# EAGLE board Vocodec_rev2_2 (EAGLE 6.5.0), part 1 of 2
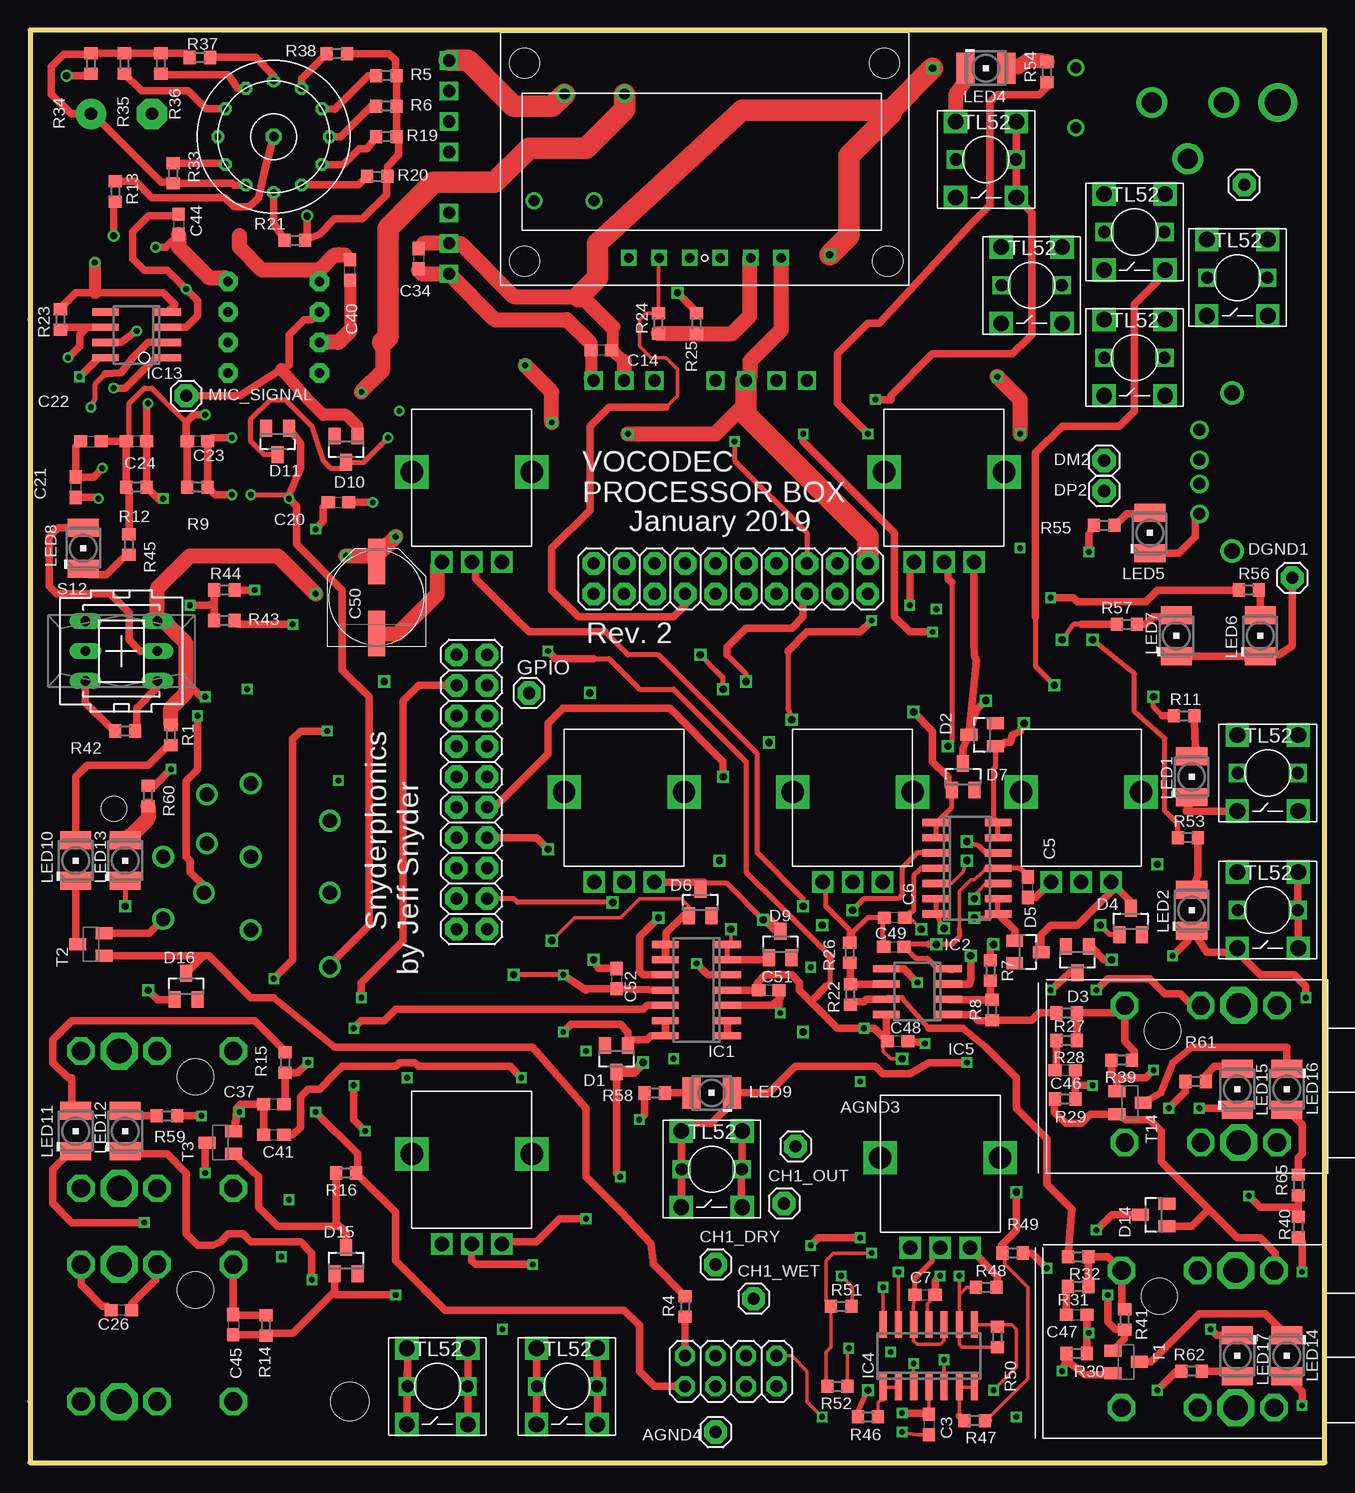
[diagram p3: board, top side]
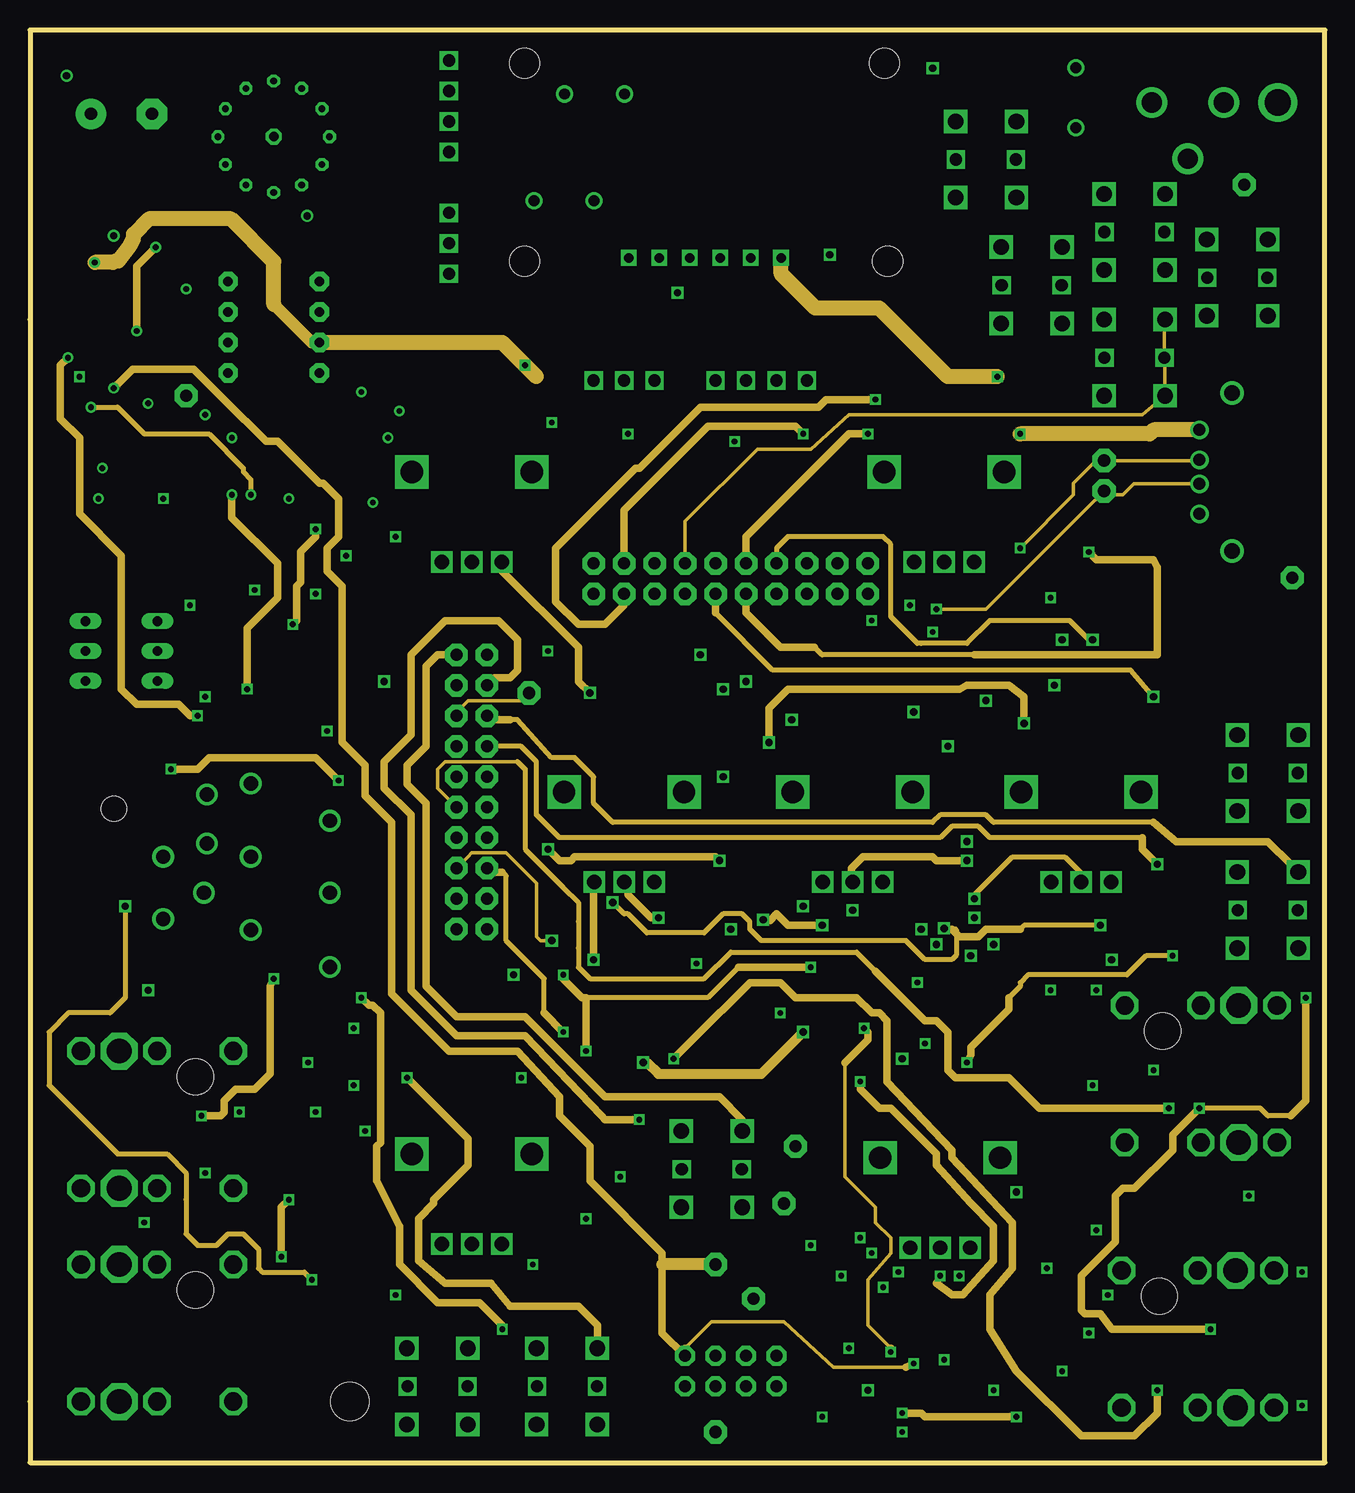
[diagram p4: board, inner layer Route2]
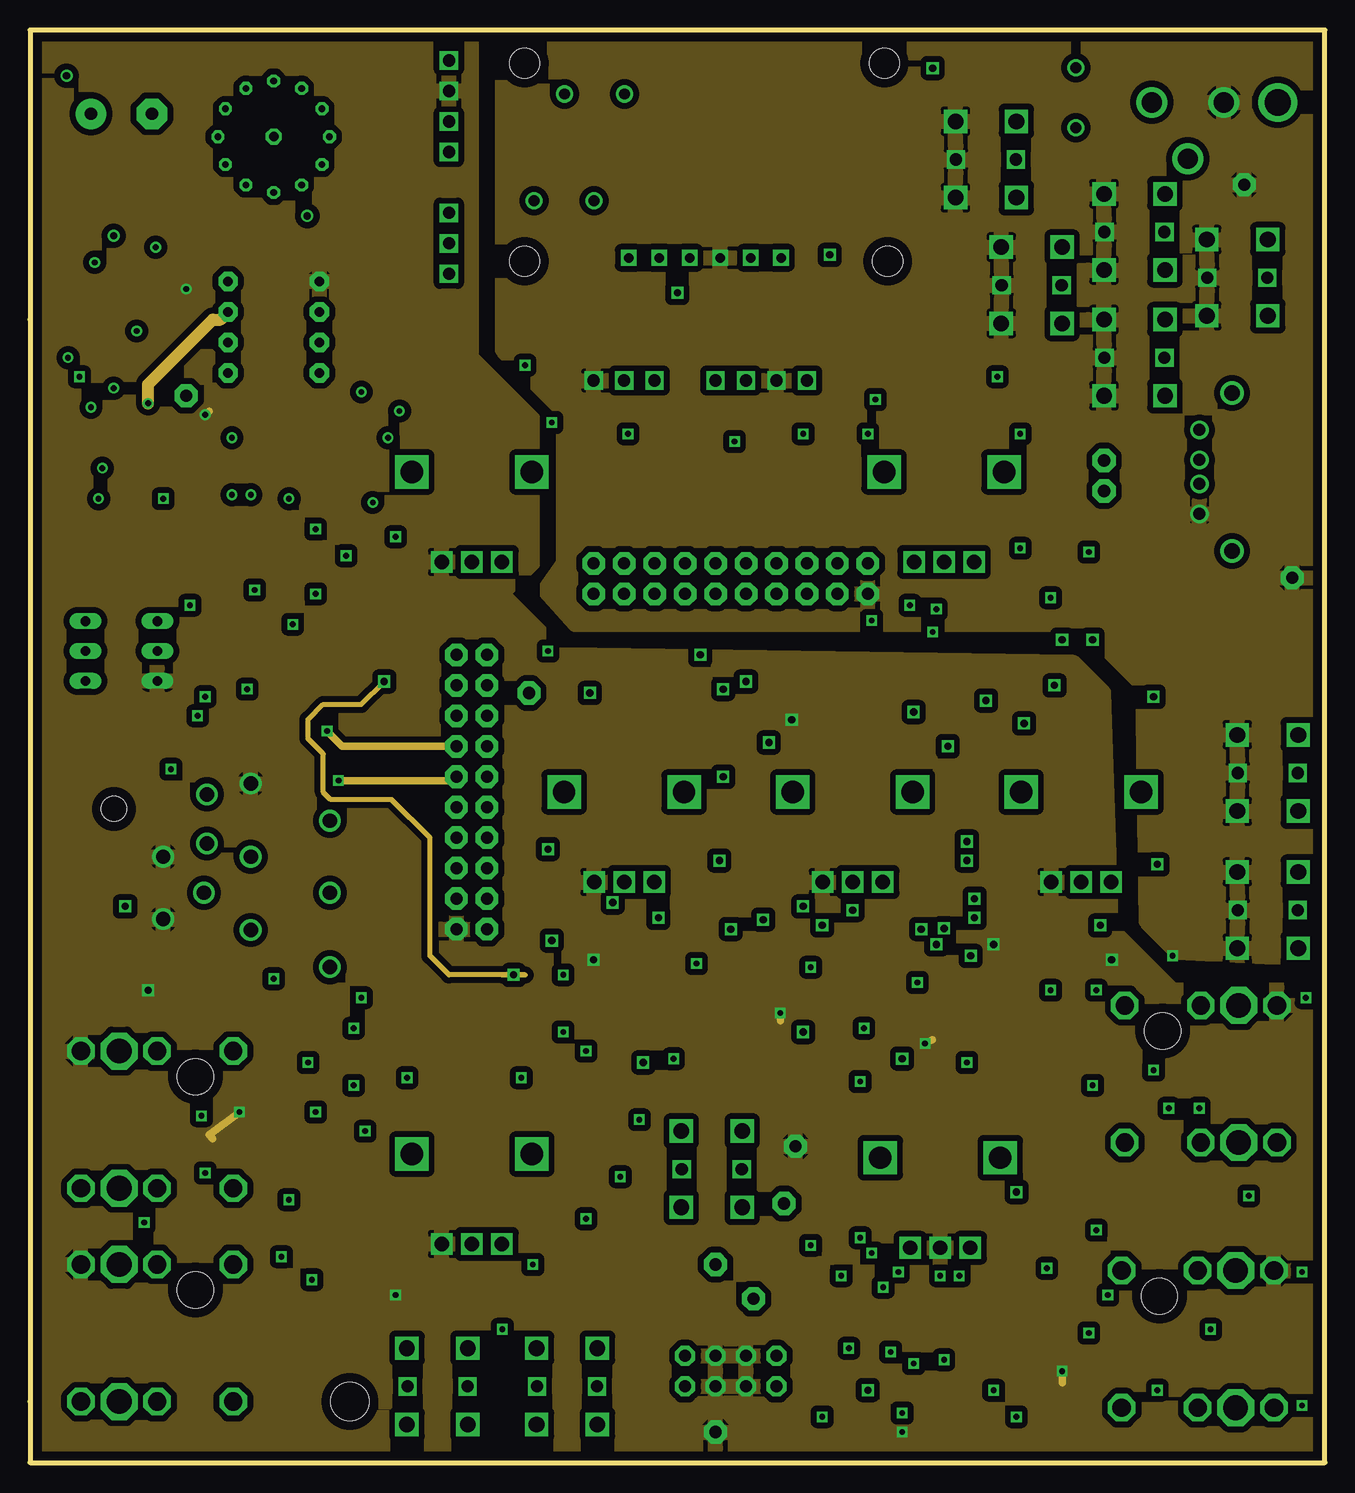
[diagram p5: board, inner layer Route15]
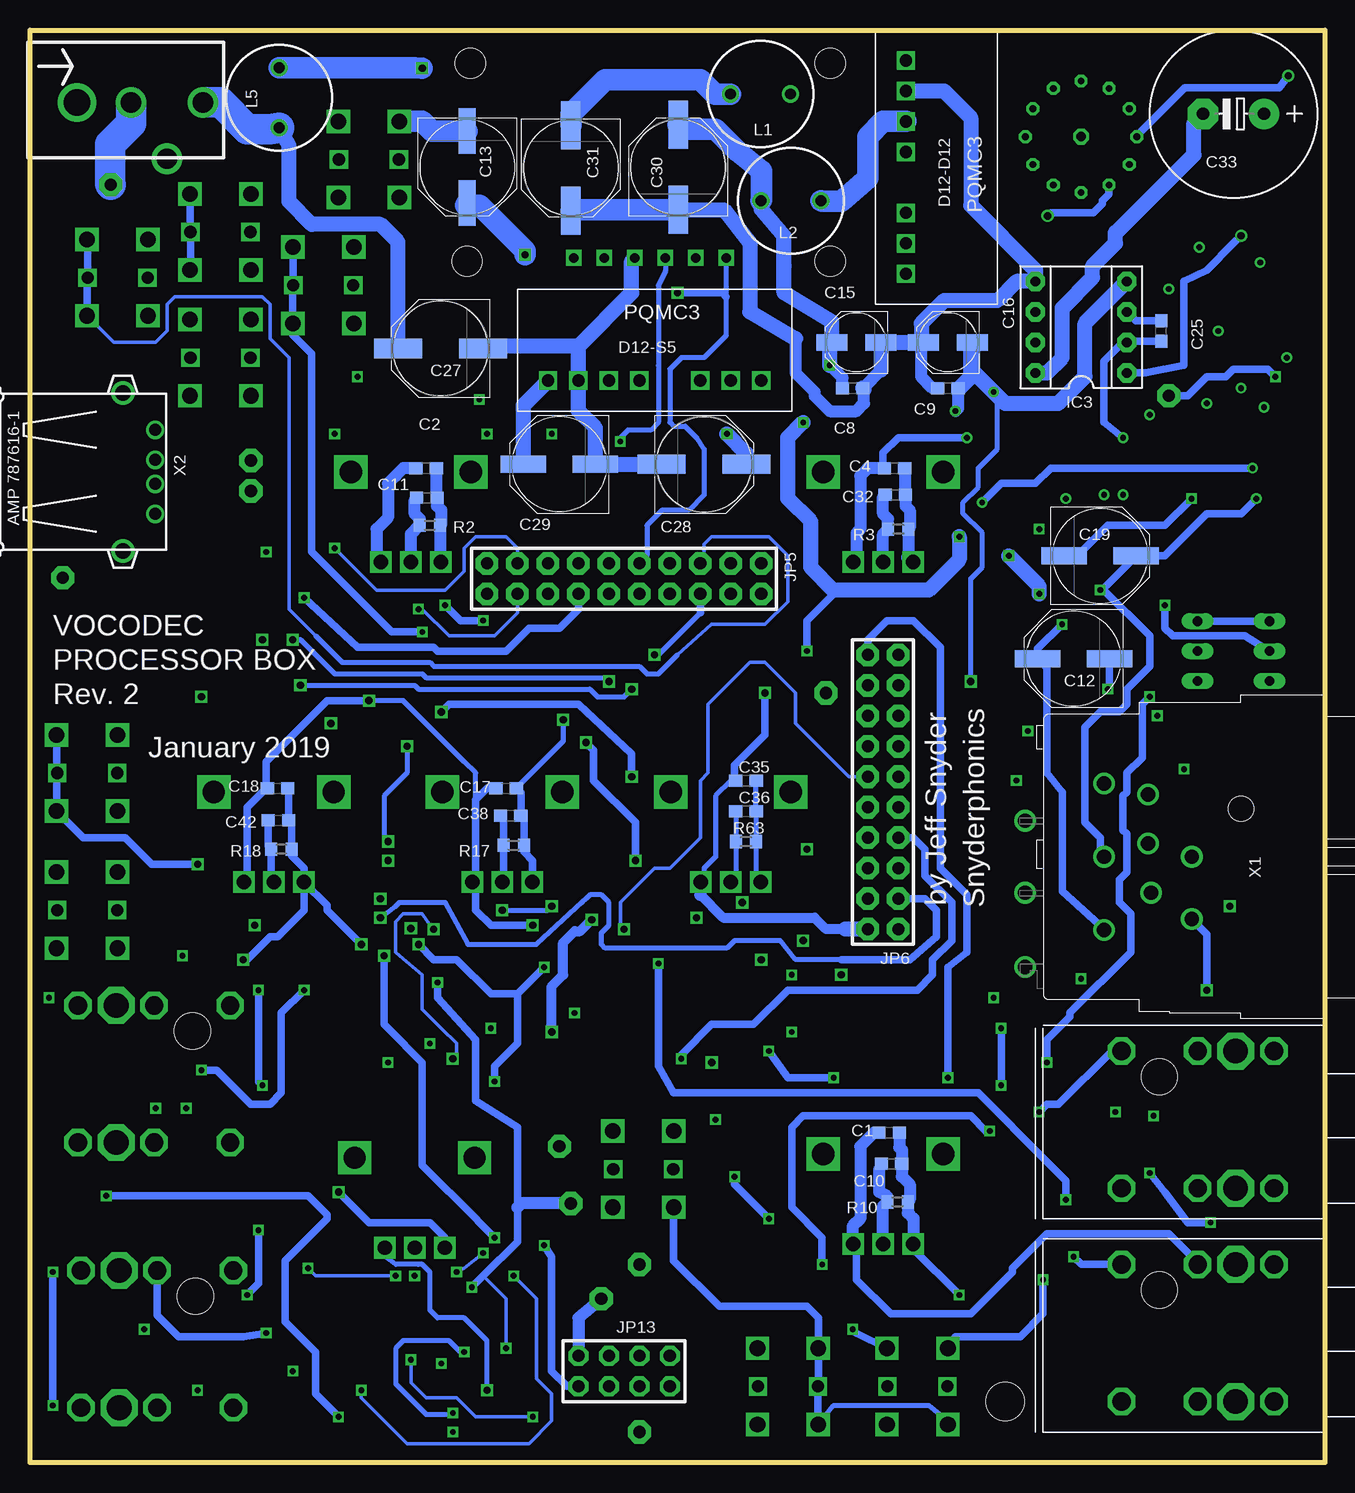
[diagram p6: board, bottom side, seen from below]

Size 107.95 x 119.38 mm. Coordinates in mm from the lower left corner, seen from the top.
Outline: 0,95.25 0,5.08 0,0 107.95,0 107.95,119.38 0,119.38 0,95.25
Copper layers (1+2*15+16): Top 0.035mm / dielectric 1mm / Route2 0.035mm / dielectric 1mm / Route15 0.035mm / dielectric 1mm / Bottom 0.035mm
Design rules "default *": minimum track width 12mil, minimum drill 19mil, track to track 20mil, track to pad 10mil, pad to pad 10mil, via to via 10mil, smd to smd 10mil, copper to edge 30mil, drill to drill 10mil, minimum pad ring 10mil, minimum via ring 8mil, stop-mask expansion 3mil, vias tented up to drill 0mil, thermal gap 10mil
Net classes: 1 POWER: width 0.813 mm, drill 0.559 mm, clearance 0.254 mm; 3 +12V: width 0.61 mm, drill 0.483 mm, clearance 0.254 mm
Holes 3.17 mm at 26.67,5.08 0,124.46 107.95,124.46 107.95,-5.08 0,-5.08
Milling: 4 lines

## Footprints (pad centres in the part's own frame; a part is rotated, then mirrored left to right if it is on the bottom)
1X01 = drill 1.016 pad 1.93 octagon: 1 0,0
C0603 = smd 1.1 x 1: 1 -0.85,0; 2 0.85,0
PANASONIC_E = smd 3.8 x 1.4: + 3,0; - -3,0
PANASONIC_C = smd 2.6 x 1.4: + 2.05,0; - -2.05,0
PANASONIC_F = smd 4 x 1.6: + 3.55,0; - -3.55,0
E5-13 = drill 1.016 pad 2.54: + -2.54,0 | drill 1.016 pad 2.54 octagon: - 2.54,0
SOT23 = smd 1 x 1.4: 1 -0.95,-1.1; 2 0.95,-1.1; 3 0,1.1
SO14 = smd 0.6 x 2.2: 1 -3.81,-2.6; 2 -2.54,-2.6; 3 -1.27,-2.6; 4 0,-2.6; 5 1.27,-2.6; 6 2.54,-2.6; 7 3.81,-2.6; 8 3.81,2.6; 9 2.54,2.6; 10 1.27,2.6; 11 0,2.6; 12 -1.27,2.6; 13 -2.54,2.6; 14 -3.81,2.6
DIL08 = drill 0.813 pad 1.6 octagon: 1 -3.81,-3.81; 2 -1.27,-3.81; 3 1.27,-3.81; 4 3.81,-3.81; 5 3.81,3.81; 6 1.27,3.81; 7 -1.27,3.81; 8 -3.81,3.81
SO08 = smd 0.6 x 2.2: 1 -1.905,-2.6; 2 -0.635,-2.6; 3 0.635,-2.6; 4 1.905,-2.6; 5 1.905,2.6; 6 0.635,2.6; 7 -0.635,2.6; 8 -1.905,2.6
PQMC3-D12-D12-S = drill 1.016 square: P$1 -7.62,0; P$2 -5.08,0; P$3 -2.54,0; P$4 2.54,0; P$5 5.08,0; P$6 7.62,0; P$7 10.16,0
SO8 = smd 0.6 x 2.2: 1 -1.905,-2.6; 2 -0.635,-2.6; 3 0.635,-2.6; 4 1.905,-2.6; 5 1.905,2.6; 6 0.635,2.6; 7 -0.635,2.6; 8 -1.905,2.6
NRJ6HF2 = drill 2.057 octagon: POST1 -7.442,0; POST2 -7.442,-11.43 | drill 1.524 octagon: R -10.6,0; RN -10.6,-11.43; S -4.25,0; SN -4.25,-11.43; T -16.942,0; TN -16.942,-11.43 | hole 2.997: -13.792,-2.134
PJ-059B = drill 1.7: 1 3,0; 2 -3,0; 3 0,-4.7 | drill 2.2: P$1 -7.5,0
2X10 = drill 1.016 pad 1.88 octagon: 1 -11.43,-1.27; 2 -11.43,1.27; 3 -8.89,-1.27; 4 -8.89,1.27; 5 -6.35,-1.27; 6 -6.35,1.27; 7 -3.81,-1.27; 8 -3.81,1.27; 9 -1.27,-1.27; 10 -1.27,1.27; 11 1.27,-1.27; 12 1.27,1.27; 13 3.81,-1.27; 14 3.81,1.27; 15 6.35,-1.27; 16 6.35,1.27; 17 8.89,-1.27; 18 8.89,1.27; 19 11.43,-1.27; 20 11.43,1.27
2X04 = drill 1.016 pad 1.676 octagon: 1 -3.81,-1.27; 2 -3.81,1.27; 3 -1.27,-1.27; 4 -1.27,1.27; 5 1.27,-1.27; 6 1.27,1.27; 7 3.81,-1.27; 8 3.81,1.27
6000-XXXX-RC = drill 0.9 pad 1.422: 1 -2.5,0; 2 2.5,0
PLCC2 = smd 2.6 x 1.5: A 0,1.7; C 0,-1.7
ADAFRUIT_128X32_OLED = drill 0.8 square: P$1 10.668,2.286; P$2 13.208,2.286; P$3 15.748,2.286; P$4 18.288,2.286; P$5 20.828,2.286; P$6 23.368,2.286 | hole 2.489: 2,2; 2,18.5; 32,18.5; 32.258,2
R0603 = smd 1 x 1.1: 1 -0.85,0; 2 0.85,0
PVA2F = drill 0.813 long: 1 -2.997,2.489; 2 -2.997,0; 3 -2.997,-2.489; 4 2.997,2.489; 5 2.997,0; 6 2.997,-2.489
SOT23-BEC = smd 1 x 1.4: B -0.95,-1.1; C 0,1.1; E 0.95,-1.1
56DP30 = drill 0.559 octagon: 1 4.023,-2.324; 2 2.324,-4.023; 3 0,-4.648; 4 -2.324,-4.023; 5 -4.023,-2.324; 6 -4.648,0; 7 -4.023,2.324; 8 -2.324,4.023; 9 0,4.648; 10 2.324,4.023; 11 4.025,2.324; 12 4.648,0 | drill 0.8 octagon: C 0,0
TL52_PLUS = drill 1.016 square: P1_1 -2.5,0; P2_1 2.5,0 | drill 1.3 square: P1_2 -2.54,3.175; P1_3 -2.54,-3.175; P2_2 2.54,3.175; P2_3 2.54,-3.175
RK09 = drill 1.2 square: 1-09 -2.5,-7.5; 2-09 0,-7.5; 3-09 2.5,-7.5 | drill 1.854 square: MOUNT1 -5,0; MOUNT2 5,0
NCJ10FI-H-0 = drill 1.2: 1 -6.1,-18.4; 2 6.1,-18.4; 3 0,-18.4; G 0,-11.1; GN -1.1,-14.75; R -5.2,-14.75; RS -3,-25; S 5.2,-11.1; SS 3,-14.5; T 9.2,-25; TS 3,-25 | hole 2.1: -4,-7
USB = drill 1: 1 -3.5,12.99; 2 -1,12.99; 3 1,12.99; 4 3.5,12.99 | drill 1.3: P$1 -6.57,10.28; P$2 6.57,10.28

## Placement (x,y rotation side)
AGND3  [1X01]  63.82,26.35 0 top
AGND4  [1X01]  57.15,2.54 0 top
C1  .1uf  [C0603]  36.32,27.5 0 bottom
C2  .1uf  [C0603]  74.93,82.87 0 bottom
C3  .1uf  [C0603]  74.93,3.17 270 top
C4  .1uf  [C0603]  35.88,82.87 0 bottom
C5  .1uf  [C0603]  83.19,47.94 90 top
C6  .1uf  [C0603]  72.07,45.4 180 top
C7  .1uf  [C0603]  74.61,13.97 0 top
C8  .33uf  [C0603]  39.37,89.53 0 bottom
C9  .33uf  [C0603]  31.43,89.53 0 bottom
C10  .01uf  [C0603]  36.13,24.89 0 bottom
C11  .01uf  [C0603]  74.87,80.39 0 bottom
C12  47uf  [PANASONIC_E]  20.96,66.99 180 bottom
C13  47uf  [PANASONIC_E]  71.5,107.95 270 bottom
C14  .1uf  [C0603]  47.62,92.71 180 top
C15  10uf  [PANASONIC_C]  39.05,93.34 180 bottom
C16  10uf  [PANASONIC_C]  31.43,93.34 180 bottom
C17  .1uf  [C0603]  68.26,56.2 0 bottom
C18  .1uf  [C0603]  87.31,56.2 0 bottom
C19  47uf  [PANASONIC_E]  18.73,75.56 0 bottom
C20  470pf  [C0603]  25.72,80.01 0 top
C21  470pf  [C0603]  3.81,81.28 270 top
C22  47pf  [C0603]  5.08,85.09 0 top
C23  100pf  [C0603]  13.97,85.09 180 top
C24  100pf  [C0603]  8.89,85.09 180 top
C25  220pf  [C0603]  13.65,94.3 90 bottom
C26  .1uf  [C0603]  7.62,12.7 180 top
C27  100uf  [PANASONIC_F]  73.72,92.84 180 bottom
C28  100uf  [PANASONIC_F]  51.75,83.19 0 bottom
C29  47uf  [PANASONIC_E]  63.82,83.19 180 bottom
C30  100uf  [PANASONIC_F]  53.91,107.95 90 bottom
C31  100uf  [PANASONIC_F]  62.86,107.89 270 bottom
C32  .01uf  [C0603]  35.81,80.64 0 bottom
C33  3300uf  [E5-13]  7.62,112.39 180 bottom
C34  .1uf  [C0603]  32.38,100.33 270 top
C35  .1uf  [C0603]  48.26,56.83 0 bottom
C36  .01uf  [C0603]  48.26,54.29 0 bottom
C37  .1uf  [C0603]  20.32,29.84 180 top
C38  .01uf  [C0603]  67.88,53.91 0 bottom
C40  .1uf  [C0603]  26.67,99.38 90 top
C41  .1uf  [C0603]  20.32,27.3 0 top
C42  .01uf  [C0603]  87.25,53.53 0 bottom
C44  .1uf  [C0603]  12.38,103.19 270 top
C45  .01uf  [C0603]  16.95,11.49 270 top
C46  220pf  [C0603]  86.3,32.7 0 top
C47  220pf  [C0603]  87.25,12.32 0 top
C48  .1uf  [C0603]  72.33,35.12 0 top
C49  .1uf  [C0603]  72.01,42.99 0 top
C50  47uf  [PANASONIC_E]  28.89,72.07 90 top
C51  .1uf  [C0603]  61.59,39.37 0 top
C52  .1uf  [C0603]  48.89,40.32 270 top
CH1_DRY  [1X01]  57.15,16.51 0 top
CH1_OUT  [1X01]  62.86,21.59 0 top
CH1_WET  [1X01]  60.33,13.65 0 top
D1  BAT54  [SOT23]  48.89,33.66 180 top
D2  BAT54  [SOT23]  79.38,60.64 90 top
D3  BAT54  [SOT23]  87.31,41.91 180 top
D4  BAT54  [SOT23]  91.76,45.09 0 top
D5  BAT54  [SOT23]  83.19,42.55 270 top
D6  BAT54  [SOT23]  55.88,46.67 0 top
D7  BAT54  [SOT23]  77.79,57.15 0 top
D9  BAT54  [SOT23]  62.55,43.18 0 top
D10  BAT54  [SOT23]  26.35,84.45 180 top
D11  BAT54  [SOT23]  20.64,85.09 180 top
D14  BAT54  [SOT23]  93.66,20.64 90 top
D15  BAT54  [SOT23]  26.35,16.83 0 top
D16  BAT54  [SOT23]  13.02,39.69 0 top
DGND1  [1X01]  105.22,73.72 0 top
DM2  [1X01]  89.53,83.5 0 top
DP2  [1X01]  89.53,80.96 0 top
GPIO  [1X01]  41.59,64.14 0 top
IC1  TL074D  [SO14]  55.56,39.37 90 top
IC2  TL074D  [SO14]  78.11,49.53 270 top
IC3  INA217P  [DIL08]  20.32,94.61 90 bottom
IC4  TL074D  [SO14]  74.93,8.89 0 top
IC5  NE5532D  [SO08]  73.98,39.24 90 top
IC11  PQMC3-D12-D12-S  [PQMC3-D12-D12-S]  34.92,106.68 90 bottom
IC12  PQMC3-D12-S5-S  [PQMC3-D12-D12-S]  54.61,90.17 180 bottom
IC13  DG469  [SO8]  8.89,93.98 90 top
J1  NRJ6HF2  [NRJ6HF2]  0,34.29 0 bottom
J3  NRJ6HF2  [NRJ6HF2]  108.2,38.1 0 top
J4  NRJ6HF2  [NRJ6HF2]  107.95,16 0 top
J9  NRJ6HF2  [NRJ6HF2]  0,16.51 0 bottom
J10  PJ-059B  [PJ-059B]  96.52,113.35 0 bottom
JP5  [2X10]  58.42,73.66 0 top
JP6  [2X10]  36.83,55.88 90 top
JP13  [2X04]  58.42,7.62 0 top
JP20  [1X01]  101.22,106.49 90 top
L1  [6000-XXXX-RC]  47.05,114.05 180 bottom
L2  [6000-XXXX-RC]  44.51,105.16 180 bottom
L5  [6000-XXXX-RC]  87.19,113.73 90 bottom
LED1  AMBER  [PLCC2]  96.84,57.15 0 top
LED2  GREEN  [PLCC2]  96.84,46.04 0 top
LED4  RED  [PLCC2]  79.69,116.2 270 top
LED5  GREEN  [PLCC2]  93.34,77.47 0 top
LED6  AMBER  [PLCC2]  102.55,68.9 0 top
LED7  RED  [PLCC2]  95.57,68.9 0 top
LED8  GREEN  [PLCC2]  4.45,76.2 0 top
LED9  GREEN  [PLCC2]  56.83,30.8 90 top
LED10  AMBER  [PLCC2]  3.81,50.16 0 top
LED11  AMBER  [PLCC2]  3.81,27.62 0 top
LED12  RED  [PLCC2]  7.94,27.62 0 top
LED13  RED  [PLCC2]  7.94,50.16 0 top
LED14  AMBER  [PLCC2]  104.77,8.89 180 top
LED15  RED  [PLCC2]  100.65,31.12 0 top
LED16  AMBER  [PLCC2]  104.77,31.12 180 top
LED17  RED  [PLCC2]  100.65,8.89 180 top
MIC_SIGNAL  [1X01]  13.02,88.9 0 top
OLED1  ADAFRUIT_931_OLED_128X32  [ADAFRUIT_128X32_OLED]  39.24,98.11 0 top
R1  1k  [R0603]  11.75,60.64 270 top
R2  1M  [R0603]  74.61,78.11 180 bottom
R3  1M  [R0603]  35.56,77.79 180 bottom
R4  200k  [R0603]  54.61,13.02 90 top
R5  1k  [R0603]  29.72,115.57 0 top
R6  2k  [R0603]  29.72,113.03 0 top
R7  10k  [R0603]  80.07,41.02 270 top
R8  10k  [R0603]  80.2,37.72 90 top
R9  1k15  [R0603]  13.97,81.28 0 top
R10  1M  [R0603]  35.62,21.72 180 bottom
R11  560R  [R0603]  96.2,62.23 0 top
R12  1k15  [R0603]  8.89,81.28 0 top
R13  5.1R  [R0603]  7.11,105.92 270 top
R14  1M  [R0603]  19.69,11.43 90 top
R15  1k  [R0603]  21.27,33.34 90 top
R16  200k  [R0603]  26.35,24.13 180 top
R17  1M  [R0603]  67.63,51.44 180 bottom
R18  1M  [R0603]  87,51.12 180 bottom
R19  4.7k  [R0603]  29.72,110.49 0 top
R20  10k  [R0603]  28.96,107.19 0 top
R21  20k  [R0603]  22.1,101.85 0 top
R22  10k  [R0603]  68.39,38.99 90 top
R23  10k  [R0603]  2.54,95.25 90 top
R24  1k  [R0603]  52.39,94.93 90 top
R25  1k  [R0603]  55.56,94.93 90 top
R26  10k  [R0603]  68.33,42.48 90 top
R27  220R  [R0603]  86.42,37.46 180 top
R28  220R  [R0603]  86.42,35.18 180 top
R29  220R  [R0603]  86.3,30.29 0 top
R30  220R  [R0603]  87.25,9.08 0 top
R31  220R  [R0603]  87.38,14.67 180 top
R32  220R  [R0603]  87.38,17.14 180 top
R33  5.1R  [R0603]  11.94,107.44 270 top
R34  15R  [R0603]  5.08,116.59 90 top
R35  47R  [R0603]  7.87,116.59 90 top
R36  91R  [R0603]  10.92,116.59 90 top
R37  200R  [R0603]  14.16,117.09 180 top
R38  510R  [R0603]  25.59,117.41 0 top
R39  200k  [R0603]  91,33.53 180 top
R40  1k  [R0603]  105.73,19.62 270 top
R41  200k  [R0603]  91.25,11.94 270 top
R42  47k  [R0603]  7.94,60.96 180 top
R43  680R  [R0603]  16.19,70.17 0 top
R44  680R  [R0603]  16.19,72.71 0 top
R45  680R  [R0603]  8.25,76.52 270 top
R46  15k  [R0603]  69.85,3.81 0 top
R47  15k  [R0603]  78.74,3.49 180 top
R48  15k  [R0603]  79.69,14.61 0 top
R49  15k  [R0603]  81.91,17.46 180 top
R50  51k  [R0603]  80.64,10.48 270 top
R51  15k  [R0603]  67.63,13.02 0 top
R52  15k  [R0603]  67.31,6.35 180 top
R53  560R  [R0603]  96.52,52.07 0 top
R54  560R  [R0603]  84.77,115.89 90 top
R55  560R  [R0603]  89.53,78.11 0 top
R56  560R  [R0603]  101.6,72.71 0 top
R57  560R  [R0603]  91.44,69.85 0 top
R58  560R  [R0603]  52.07,30.8 0 top
R59  560R  [R0603]  11.43,28.89 180 top
R60  560R  [R0603]  9.84,55.56 270 top
R61  560R  [R0603]  97.16,31.75 0 top
R62  560R  [R0603]  96.84,7.62 0 top
R63  1M  [R0603]  48.26,51.75 180 bottom
R65  1k  [R0603]  105.73,23.11 90 top
S12  PVA2  [PVA2F]  7.62,67.63 180 top
T1  [SOT23-BEC]  91.38,8.38 270 top
T2  [SOT23-BEC]  5.08,43.18 90 top
T3  [SOT23-BEC]  15.87,26.67 90 top
T14  [SOT23-BEC]  91.69,29.97 270 top
U$1  56DP30  [56DP30]  20.32,110.49 270 top
U$7  TL52_PLUS  [TL52_PLUS]  79.69,108.58 0 top
U$11  TL52_PLUS  [TL52_PLUS]  92.08,102.55 0 top
U$12  RK09  [RK09]  36.83,25.72 0 top
U$14  RK09  [RK09]  75.88,25.4 0 top
U$16  RK09  [RK09]  49.53,55.88 0 top
U$27  RK09  [RK09]  87.63,55.88 0 top
U$28  RK09  [RK09]  68.58,55.88 0 top
U$31  RK09  [RK09]  76.2,82.55 0 top
U$32  RK09  [RK09]  36.83,82.55 0 top
U$33  TL52_PLUS  [TL52_PLUS]  100.65,98.74 0 top
U$39  TL52_PLUS  [TL52_PLUS]  83.5,98.11 0 top
U$40  TL52_PLUS  [TL52_PLUS]  92.08,92.08 0 top
U$42  TL52_PLUS  [TL52_PLUS]  103.19,57.47 0 top
U$43  TL52_PLUS  [TL52_PLUS]  103.19,46.04 0 top
U$44  TL52_PLUS  [TL52_PLUS]  56.83,24.45 0 top
U$45  TL52_PLUS  [TL52_PLUS]  44.77,6.35 0 top
U$48  TL52_PLUS  [TL52_PLUS]  33.97,6.35 0 top
X1  NCJ10FI-H-0  [NCJ10FI-H-0]  0,50.48 270 bottom
X2  [USB]  110.49,82.55 270 bottom